# Altium schematic sheet MICRO.SchDoc
size A4
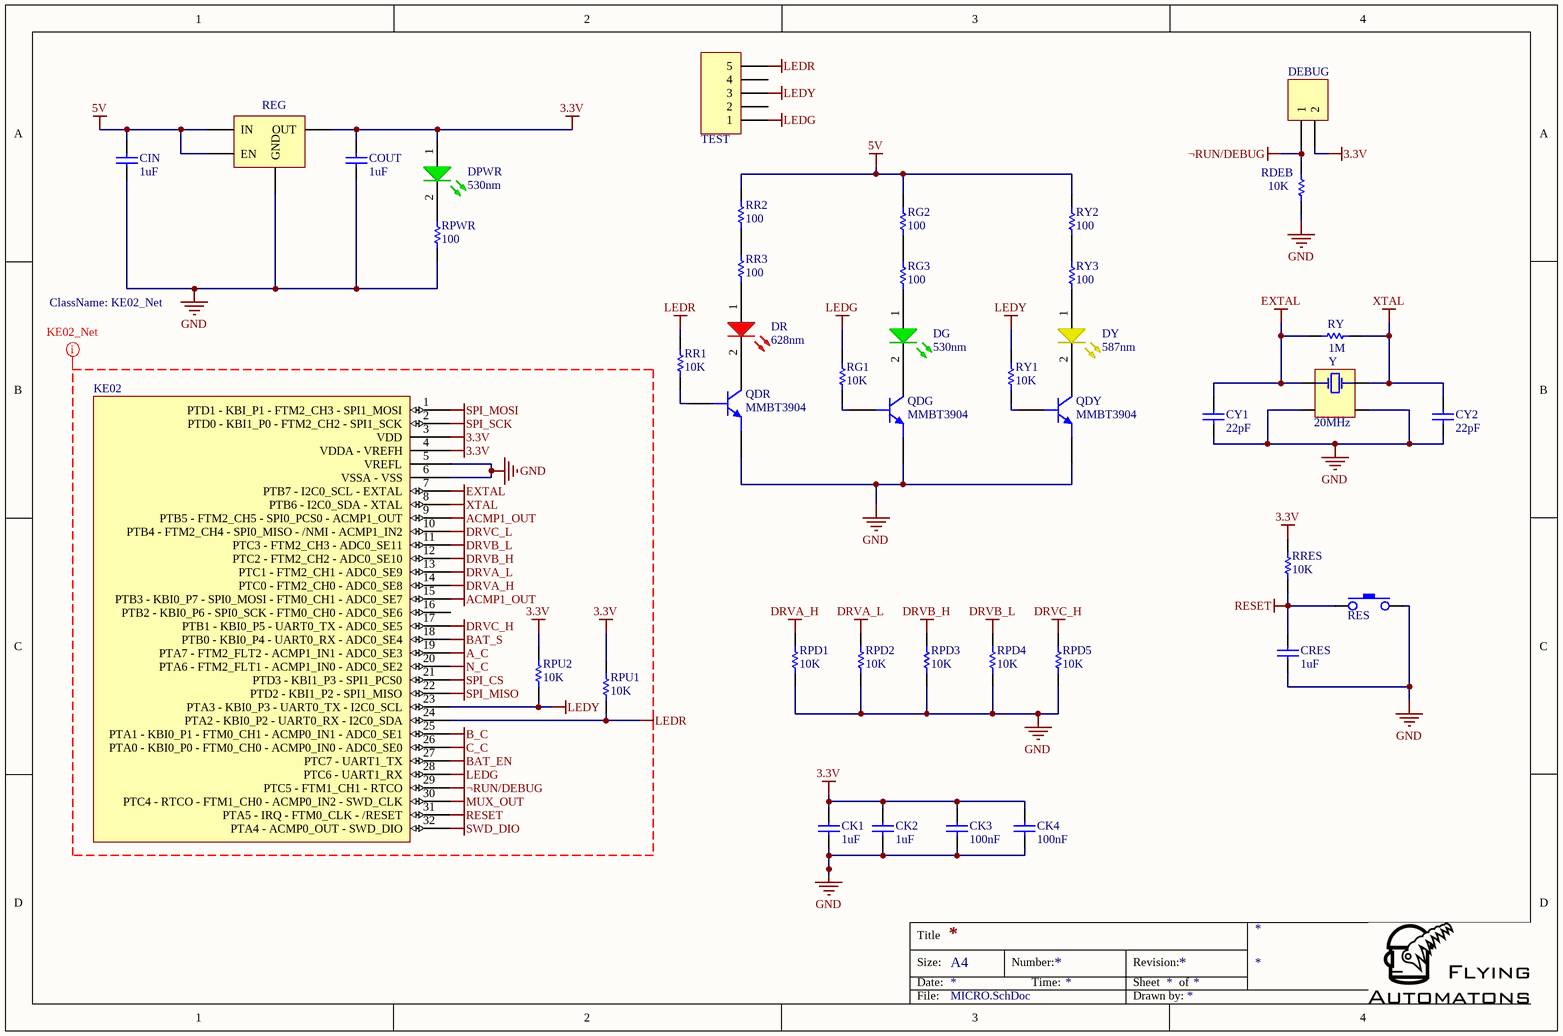
[diagram p0: MICRO.SchDoc]

## Parts
CIN  1uF  [CAPC1608L]
CK1  1uF  [CAPC1608L]
CK2  1uF  [CAPC1608L]
CK3  100nF  [CAPC1608L]
CK4  100nF  [CAPC1608L]
COUT  1uF  [CAPC1608L]
CRES  1uF  [CAPC1608L]
CY1  22pF  [CAPC1608L]
CY2  22pF  [CAPC1608L]
DEBUG  Header 2  [Pines 1x2]  (value not drawn)
DG  value 530nm  [DSO-F2/D3.4]  (hidden comment: LED-GREEN)
DPWR  value 530nm  [DSO-F2/D3.4]  (hidden comment: LED-GREEN)
DR  value 628nm  [DSO-F2/D3.4]  (hidden comment: LED-RED)
DY  value 587nm  [DSO-F2/D3.4]  (hidden comment: LED-YELLOW)
KE02  MKE02ZxxVLC2(R)  [JEDEC_MS-026BBA]  (value not drawn)
QDG  value MMBT3904  [SOT23-3L]  (hidden comment: BJT-NPN-BEC)
QDR  value MMBT3904  [SOT23-3L]  (hidden comment: BJT-NPN-BEC)
QDY  value MMBT3904  [SOT23-3L]  (hidden comment: BJT-NPN-BEC)
RDEB  10K  [RESC1608L]
REG  LP5900  [x-TI_S-NGF0006A]  (value not drawn)
RES  SWITCH_TACTILE_SPST-2T-NO  [X-TECO_FSMSM]  (value not drawn)
RG1  10K  [RESC1608L]
RG2  100  [RESC1608L]
RG3  100  [RESC1608L]
RPD1  10K  [RESC1608L]
RPD2  10K  [RESC1608L]
RPD3  10K  [RESC1608L]
RPD4  10K  [RESC1608L]
RPD5  10K  [RESC1608L]
RPU1  10K  [RESC1608L]
RPU2  10K  [RESC1608L]
RPWR  100  [RESC1608L]
RR1  10K  [RESC1608L]
RR2  100  [RESC1608L]
RR3  100  [RESC1608L]
RRES  10K  [RESC1608L]
RY  1M  [RESC1608L]
RY1  10K  [RESC1608L]
RY2  100  [RESC1608L]
RY3  100  [RESC1608L]
TEST  Header 5  [Pines 1x5]  (value not drawn)
Y  20MHz  [X-EPSO_TSX-3225]

## Nets
3.3V: CK1.1 CK2.1 CK3.1 CK4.1 COUT.1 DEBUG.2 DPWR.1(A) KE02.3(VDD) KE02.4(VDDA_-_VREFH) REG.1(OUT) RPU1.1 RPU2.1 RRES.1
5V: CIN.1 REG.4(EN) REG.6(IN) RG2.1 RR2.1 RY2.1
A_C: KE02.19(PTA7_-_FTM2_FLT2_-_ACMP1_IN1_-_ADC0_SE3)
ACMP1_OUT: KE02.9(PTB5_-_FTM2_CH5_-_SPI0_PCS0_-_ACMP1_OUT) KE02.15(PTB3_-_KBI0_P7_-_SPI0_MOSI_-_FTM0_CH1_-_ADC0_SE7)
B_C: KE02.25(PTA1_-_KBI0_P1_-_FTM0_CH1_-_ACMP0_IN1_-_ADC0_SE1)
BAT_EN: KE02.27(PTC7_-_UART1_TX)
BAT_S: KE02.18(PTB0_-_KBI0_P4_-_UART0_RX_-_ADC0_SE4)
C_C: KE02.26(PTA0_-_KBI0_P0_-_FTM0_CH0_-_ACMP0_IN0_-_ADC0_SE0)
DRVA_H: KE02.14(PTC0_-_FTM2_CH0_-_ADC0_SE8) RPD1.1
DRVA_L: KE02.13(PTC1_-_FTM2_CH1_-_ADC0_SE9) RPD2.1
DRVB_H: KE02.12(PTC2_-_FTM2_CH2_-_ADC0_SE10) RPD3.1
DRVB_L: KE02.11(PTC3_-_FTM2_CH3_-_ADC0_SE11) RPD4.1
DRVC_H: KE02.17(PTB1_-_KBI0_P5_-_UART0_TX_-_ADC0_SE5) RPD5.1
DRVC_L: KE02.10(PTB4_-_FTM2_CH4_-_SPI0_MISO_-_/NMI_-_ACMP1_IN2)
EXTAL: CY1.1 KE02.7(PTB7_-_I2C0_SCL_-_EXTAL) RY.2 Y.1
GND: CIN.2 CK1.2 CK2.2 CK3.2 CK4.2 COUT.2 CRES.1 CY1.2 CY2.2 KE02.5(VREFL) KE02.6(VSSA_-_VSS) QDG.2(E) QDR.2(E) QDY.2(E) RDEB.2 REG.3(GND) RES.2 RPD1.2 RPD2.2 RPD3.2 RPD4.2 RPD5.2 RPWR.2 Y.2 Y.4
LEDG: KE02.28(PTC6_-_UART1_RX) RG1.1 TEST.1
LEDR: KE02.24(PTA2_-_KBI0_P2_-_UART0_RX_-_I2C0_SDA) RPU1.2 RR1.1 TEST.5
LEDY: KE02.23(PTA3_-_KBI0_P3_-_UART0_TX_-_I2C0_SCL) RPU2.2 RY1.1 TEST.3
MUX_OUT: KE02.30(PTC4_-_RTCO_-_FTM1_CH0_-_ACMP0_IN2_-_SWD_CLK)
N_C: KE02.20(PTA6_-_FTM2_FLT1_-_ACMP1_IN0_-_ADC0_SE2)
RESET: CRES.2 KE02.31(PTA5_-_IRQ_-_FTM0_CLK_-_/RESET) RES.1 RRES.2
SPI_CS: KE02.21(PTD3_-_KBI1_P3_-_SPI1_PCS0)
SPI_MISO: KE02.22(PTD2_-_KBI1_P2_-_SPI1_MISO)
SPI_MOSI: KE02.1(PTD1_-_KBI_P1_-_FTM2_CH3_-_SPI1_MOSI)
SPI_SCK: KE02.2(PTD0_-_KBI1_P0_-_FTM2_CH2_-_SPI1_SCK)
SWD_DIO: KE02.32(PTA4_-_ACMP0_OUT_-_SWD_DIO)
XTAL: CY2.1 KE02.8(PTB6_-_I2C0_SDA_-_XTAL) RY.1 Y.3
¬RUN/DEBUG: DEBUG.1 KE02.29(PTC5_-_FTM1_CH1_-_RTCO) RDEB.1
NetDG_1: DG.1(A) RG3.2
NetDG_2: DG.2(K) QDG.3(C)
NetDPWR_2: DPWR.2(K) RPWR.1
NetDR_1: DR.1(A) RR3.2
NetDR_2: DR.2(K) QDR.3(C)
NetDY_1: DY.1(A) RY3.2
NetDY_2: DY.2(K) QDY.3(C)
NetQDG_1: QDG.1(B) RG1.2
NetQDR_1: QDR.1(B) RR1.2
NetQDY_1: QDY.1(B) RY1.2
NetRG2_2: RG2.2 RG3.1
NetRR2_2: RR2.2 RR3.1
NetRY2_2: RY2.2 RY3.1

Not connected (* = marked no-connect by the designer): KE02 16(PTB2_-_KBI0_P6_-_SPI0_SCK_-_FTM0_CH0_-_ADC0_SE6); TEST 2 4

## Layout directives
net class KE02_Net; rule Width Constraint [Pref Width = 17.716mil    Min Width = 10mil    Max Width = 20mil]: 3.3V, A_C, ACMP1_OUT, B_C, BAT_EN, BAT_S, C_C, DRVA_H, DRVA_L, DRVB_H, DRVB_L, DRVC_H, DRVC_L, EXTAL, GND, LEDG, LEDR, LEDY, MUX_OUT, N_C, RESET, SPI_CS, SPI_MISO, SPI_MOSI, SPI_SCK, SWD_DIO, XTAL, ¬RUN/DEBUG

## Notes on the sheet
- Title
- Size:
- Date:
- A4
- Number:
- Time:
- Revision:
- Sheet
- of
- File:
- Drawn by:

## Library data of the parts
CIN CK1 CK2 COUT CRES = CAP_1u_0603_25V_X5R_10%: CAP CER 1UF 25V 10% X5R 0603; Manufacturer Part Number: TMK107BJ105KA-T; Name: CAP_1u_0603_25V_X5R_10%; Value: 1uF; Supplier 1: Digi-Key; Supplier Part Number 1: 587-1248-1-ND
CK3 CK4 = CAP_100n_0603_50V_Y5V: CAP CER 0.1UF 50V Y5V 0603; Manufacturer Part Number: CC0603ZRY5V9BB104; Name: CAP_100n_0603_50V_Y5V; Value: 100nF; Supplier 1: Digi-Key; Supplier Part Number 1: 311-1343-1-ND
CY1 CY2 = CAP_22p_0603_50V_NP0_5%: CAP CER 22PF 50V 5% NP0 0603; Manufacturer Part Number: CL10C220JB8NCNC; Name: CAP_22p_0603_50V_NP0_5%; Value: 22pF; Supplier 1: Digi-Key; Supplier Part Number 1: 1276-2227-1-ND
DEBUG = Header 2: Header, 2-Pin; LatestRevisionDate: 17-Jul-2002; LatestRevisionNote: Re-released for DXP Platform.; Publisher: Altium Limited
DG DPWR = LED_GREEN_0603_530: LED CHIPLED 570NM GREEN 0603 SMD; Manufacturer: OSRAM Opto Semiconductors Inc; Manufacturer Part Number: LG Q971-KN-1; Drawn By: Juan I Carrano; Name: LED_GREEN_0603_530; Supplier 1: Digi-Key; Supplier Part Number 1: 475-1409-1-ND
DR = LED_RED_0603_628: LED POINTLED 628NM SUPER RED SMD; Manufacturer: OSRAM Opto Semiconductors Inc; Manufacturer Part Number: LS Q971-KN-1; Drawn By: Juan I Carrano; Name: LED_RED_0603_628; Supplier 1: Digi-Key; Supplier Part Number 1: 475-3016-1-ND
DY = LED_YELLOW_0603_587: LED CHIPLED 587NM YLW 0603 SMD; Manufacturer: OSRAM Opto Semiconductors Inc; Manufacturer Part Number: LY Q976-P1S2-36; Drawn By: Juan I Carrano; Name: LED_YELLOW_0603_587; Supplier 1: Digi-Key; Supplier Part Number 1: 475-2558-1-ND
KE02 = MKE02Z64VLC2(R): Kinetis KE02 Cortex®-M0+ MCU 32 Pin LQFP; Manufacturer: Freescale; Name: MKE02Z64VLC2(R); Manufacturer Part Number: MKE02Z64VLC2(R)
QDG QDR QDY = MMBT3904: TRANSISTOR NPN 40V 0.2A SOT23; Manufacturer: NXP Semiconductors; Name: MMBT3904; Manufacturer Part Number: MMBT3904; Supplier 1: Digi-Key; Supplier Part Number 1: 568-4510-1-ND
RDEB RG1 RPD1-RPD5 RPU1 RPU2 RR1 RRES RY1 = RES_10K_0603_0W1_1%: RES 10K OHM 1/10W 5% 0603; Manufacturer Part Number: RC1608J103CS; Name: RES_10K_0603_0W1_1%; Value: 10K; Supplier 1: Digi-Key; Supplier Part Number 1: 1276-5086-1-ND
REG = x-TI_LP5900: IC REG LDO 3.3V 0.15A 6WSON; Manufacturer: Texas Instruments; Manufacturer Part Number: LP5900SD-3.3/NOPB; Name: x-TI_LP5900; Supplier 1: Digi-Key; Supplier Part Number 1: LP5900SD-3.3/NOPBCT-ND
RES = SW_TACT_3.5x6mm_SMT: SWITCH TACTILE SPST-NO 0.05A 12V; Manufacturer: TE Connectivity; Manufacturer Part Number: FSMSM; Name: SW_TACT_3.5x6mm_SMT; Supplier 1: Digi-Key; Supplier Part Number 1: 450-1140-ND
RG2 RG3 RPWR RR2 RR3 RY2 RY3 = RES_100_0603_0W1_1%: RES 100 OHM 1/10W 5% 0603 SMD; Manufacturer Part Number: RC0603JR-07100RL; Name: RES_100_0603_0W1_1%; Value: 100; Supplier 1: Digi-Key; Supplier Part Number 1: 311-100GRCT-ND
RY = RES_1M_0603_0W1_1%: RES 1.00M OHM 1/10W 1% 0603 SMD; Manufacturer: Yageo; Manufacturer Part Number: RC0603FR-071ML; Name: RES_1M_0603_0W1_1%; Value: 1M; Supplier 1: Digi-Key; Supplier Part Number 1: 311-1.00MHRCT-ND
TEST = Header 5: Header, 5-Pin; LatestRevisionDate: 17-Jul-2002; LatestRevisionNote: Re-released for DXP Platform.; Publisher: Altium Limited
Y = XTAL_20M_SMD_9p: CRYSTAL 20MHZ 9PF SMD; Manufacturer: EPSON; Manufacturer Part Number: TSX-3225 20.0000MF20G-AC3; Drawn By: Juan I Carrano; Name: XTAL_20M_SMD_9p; Value: 20MHz; Supplier 1: Digi-Key; Supplier Part Number 1: SER3629CT-ND